# EAGLE design Skaarhoj VU board with LEDs (EAGLE 6.2)
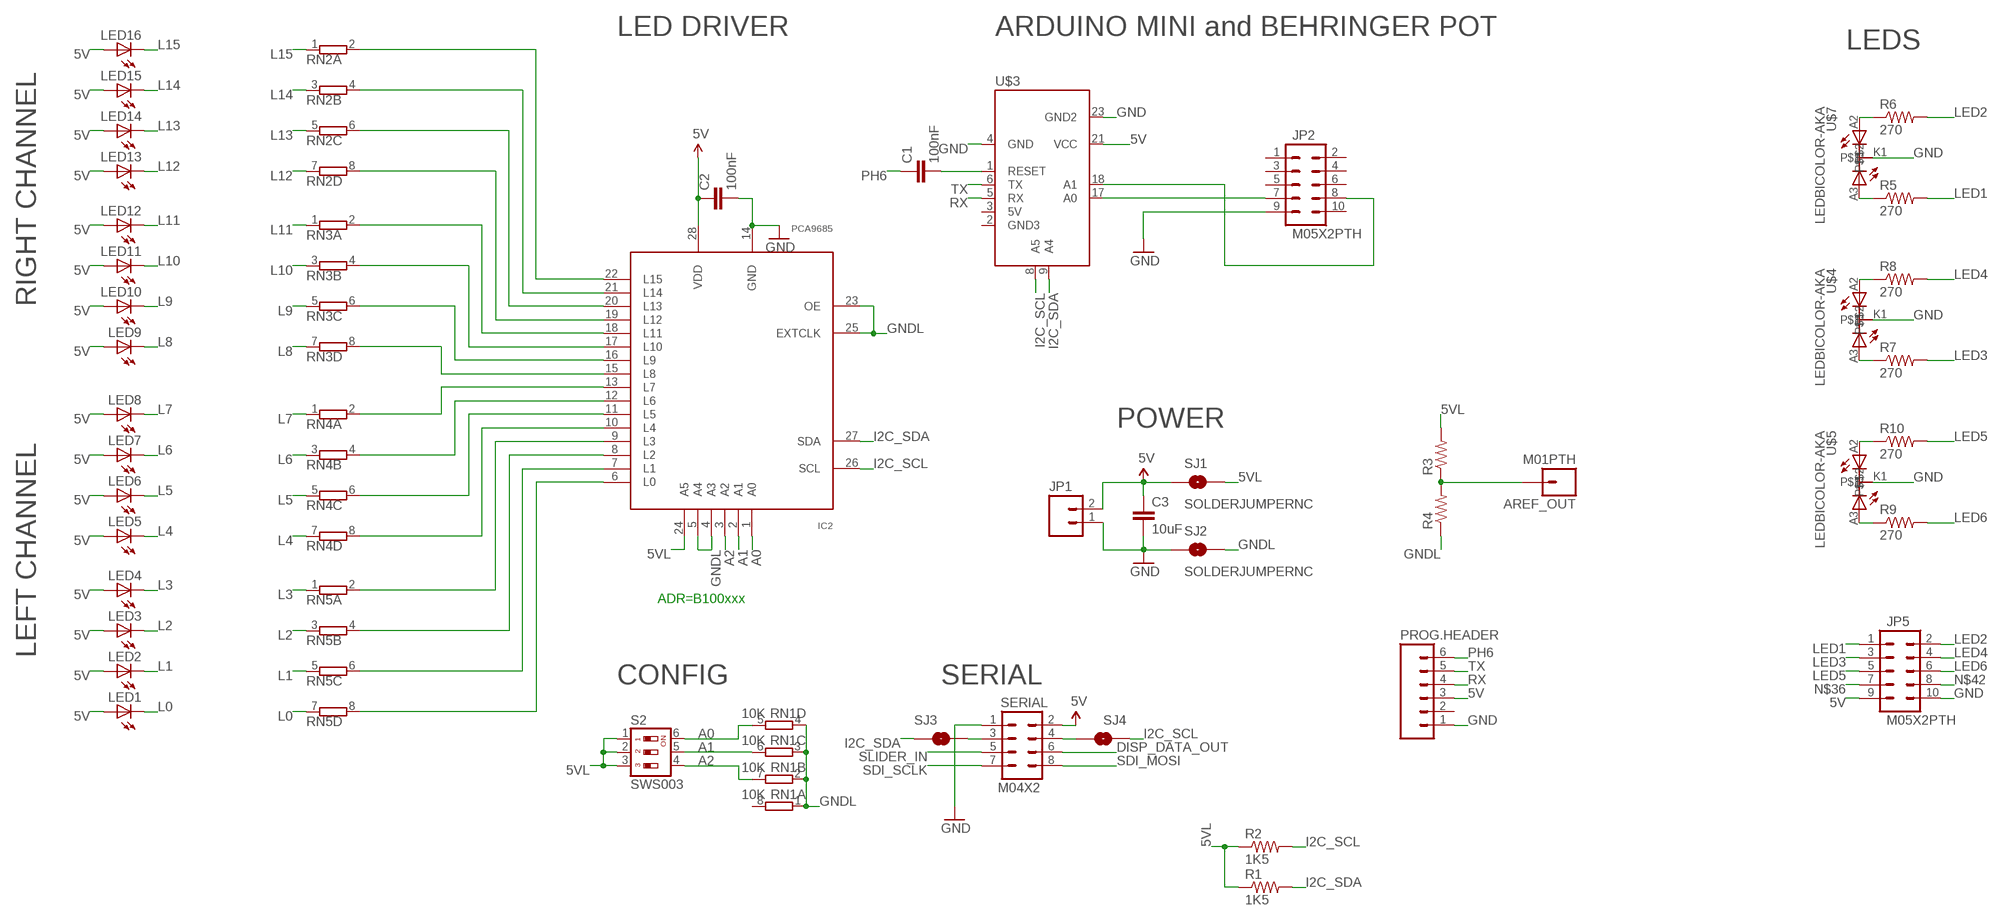
[diagram p0: schematic, sheet 1]

## Parts
AREF_OUT  M01PTH  [1X01]
C1  100nF  CAP0603-CAP  [0603-CAP]
C2  100nF  CAP0603-CAP  [0603-CAP]
C3  10uF  CAP0805  [0805]
IC2  PCA9685  [TSSOP28]
JP1  M02PTH  [1X02]
JP2  M05X2PTH  [AVR_ICSP]
JP5  M05X2PTH  [AVR_ICSP]
LED1  LED3MM  [LED3MM]
LED2  LED3MM  [LED3MM]
LED3  LED3MM  [LED3MM]
LED4  LED3MM  [LED3MM]
LED5  LED3MM  [LED3MM]
LED6  LED3MM  [LED3MM]
LED7  LED3MM  [LED3MM]
LED8  LED3MM  [LED3MM]
LED9  LED3MM  [LED3MM]
LED10  LED3MM  [LED3MM]
LED11  LED3MM  [LED3MM]
LED12  LED3MM  [LED3MM]
LED13  LED3MM  [LED3MM]
LED14  LED3MM  [LED3MM]
LED15  LED3MM  [LED3MM]
LED16  LED3MM  [LED3MM]
PROG.HEADER  M06LOCK  [1X06_LOCK]
R1  1K5  RESISTOR0603-RES  [0603-RES]
R2  1K5  RESISTOR0603-RES  [0603-RES]
R3  RESISTOR0603-RES  [0603-RES]
R4  RESISTOR0603-RES  [0603-RES]
R5  270  RESISTOR0603-RES  [0603-RES]
R6  270  RESISTOR0603-RES  [0603-RES]
R7  270  RESISTOR0603-RES  [0603-RES]
R8  270  RESISTOR0603-RES  [0603-RES]
R9  270  RESISTOR0603-RES  [0603-RES]
R10  270  RESISTOR0603-RES  [0603-RES]
RN1  10K  4R-NCAY16  [CAY16_HAND]
RN2  E4R  [SIL8]
RN3  E4R  [SIL8]
RN4  E4R  [SIL8]
RN5  E4R  [SIL8]
S2  SWS003  [SMS-003]
SERIAL  M04X2  [2X4]
SJ1  SOLDERJUMPERNC  [SJ_2S]
SJ2  SOLDERJUMPERNC  [SJ_2S]
SJ3  SOLDERJUMPERNC  [SJ_2S]
SJ4  SOLDERJUMPERNC  [SJ_2S]
U$3  ARDUINO_MINI_SE1  [ARDUINO_MINI_SE1]
U$4  LEDBICOLOR-AKA  [LED5MM-BICOLOR]
U$5  LEDBICOLOR-AKA  [LED5MM-BICOLOR]
U$7  LEDBICOLOR-AKA  [LED5MM-BICOLOR]

## Nets
5V [Power]: C2.1 C3.1 IC2.28(VDD) JP1.2 JP5.9 LED1.A LED2.A LED3.A LED4.A LED5.A LED6.A LED7.A LED8.A LED9.A LED10.A LED11.A LED12.A LED13.A LED14.A LED15.A LED16.A PROG.HEADER.3 SERIAL.2 SJ1.1 U$3.21(VCC)
5VL: IC2.24(A5) R1.1 R2.1 R3.2 S2.1 S2.2 S2.3 SJ1.2
A0: IC2.1(A0) RN1.5 S2.6
A1: IC2.2(A1) RN1.6 S2.5
A2: IC2.3(A2) RN1.7 S2.4
AREF: AREF_OUT.1 R3.1 R4.2
DISP_DATA_OUT: SERIAL.6
GND [Power]: C2.2 C3.2 IC2.14(GND) JP1.1 JP2.9 JP5.10 PROG.HEADER.1 SERIAL.1 SJ2.1 U$3.4(GND) U$3.23(GND2) U$4.K1 U$5.K1 U$7.K1
GNDL: IC2.4(A3) IC2.5(A4) IC2.23(OE) IC2.25(EXTCLK) R4.1 RN1.1 RN1.2 RN1.3 RN1.4 SJ2.2
I2C_SCL: IC2.26(SCL) R2.2 SJ4.2 U$3.8(A5)
I2C_SDA: IC2.27(SDA) R1.2 SJ3.1 U$3.9(A4)
L0: LED1.K(C) RN5.7
L1: LED2.K(C) RN5.5
L2: LED3.K(C) RN5.3
L3: LED4.K(C) RN5.1
L4: LED5.K(C) RN4.7
L5: LED6.K(C) RN4.5
L6: LED7.K(C) RN4.3
L7: LED8.K(C) RN4.1
L8: LED9.K(C) RN3.7
L9: LED10.K(C) RN3.5
L10: LED11.K(C) RN3.3
L11: LED12.K(C) RN3.1
L12: LED13.K(C) RN2.7
L13: LED14.K(C) RN2.5
L14: LED15.K(C) RN2.3
L15: LED16.K(C) RN2.1
LED1: JP5.1 R5.2
LED2: JP5.2 R6.2
LED3: JP5.3 R7.2
LED4: JP5.4 R8.2
LED5: JP5.5 R10.2
LED6: JP5.6 R9.2
N$3: SERIAL.3 SJ3.2
N$4: IC2.13(L7) RN4.2
N$5: IC2.12(L6) RN4.4
N$6: SERIAL.4 SJ4.1
N$7: IC2.11(L5) RN4.6
N$9: IC2.10(L4) RN4.8
N$10: IC2.9(L3) RN5.2
N$11: IC2.8(L2) RN5.4
N$12: IC2.7(L1) RN5.6
N$16: JP2.8 U$3.18(A1)
N$17: JP2.7 U$3.17(A0)
N$18: R6.1 U$7.A2
N$19: IC2.6(L0) RN5.8
N$20: IC2.15(L8) RN3.8
N$21: IC2.16(L9) RN3.6
N$22: IC2.17(L10) RN3.4
N$23: IC2.18(L11) RN3.2
N$24: IC2.19(L12) RN2.8
N$25: IC2.20(L13) RN2.6
N$26: IC2.21(L14) RN2.4
N$27: IC2.22(L15) RN2.2
N$28: R5.1 U$7.A3
N$29: R8.1 U$4.A2
N$30: R7.1 U$4.A3
N$31: R10.1 U$5.A2
N$32: R9.1 U$5.A3
N$36: JP5.7
N$37: C1.2 U$3.1(RESET)
N$42: JP5.8
PH6: C1.1 PROG.HEADER.6
RX: PROG.HEADER.4 U$3.5(RX)
SDI_MOSI: SERIAL.8
SDI_SCLK: SERIAL.7
SLIDER_IN: SERIAL.5
TX: PROG.HEADER.5 U$3.6(TX)
Unconnected: JP2.1 JP2.2 JP2.3 JP2.4 JP2.5 JP2.6 JP2.10 PROG.HEADER.2 RN1.8 U$3.2(GND3) U$3.3(5V)

## Notes on the sheet
- LED DRIVER | ARDUINO MINI and BEHRINGER POT
- LEDS
- RIGHT CHANNEL
- POWER
- ADR=B100xxx
- LEFT CHANNEL
- CONFIG | SERIAL

## Library data of the parts
AREF_OUT = SparkFun:M01: Header 1 Standard 1-pin 0.1" header. Use with straight break away headers (SKU : PRT-00116), right angle break away headers (PRT-00553), swiss pins (PRT-00743), machine pins (PRT-00117), and female headers (PRT-00115).
C1-C3 = SparkFun:CAP: Capacitor Standard 0603 ceramic capacitor, and 0.1" leaded capacitor.
IC2 = wsmith:PCA9685
JP1 = SparkFun:M02: Header 2 Standard 2-pin 0.1" header. Use with straight break away headers (SKU : PRT-00116), right angle break away headers (PRT-00553), swiss pins (PRT-00743), machine pins (PRT-00117), and female headers (PRT-00115). Molex polarized connector foot print use with SKU : PRT-08233 with associated crimp pins and housings.
JP2 JP5 = SparkFun:M05X2: Header 5x2 Standard 10-pin dual row 0.1" header. Commonly used with AVR-ISP. Use with Spark Fun Electronics SKU: PRT-00778
LED1-LED16 = SparkFun:LED: LEDs Standard schematic elements and footprints for 5mm, 3mm, 1206, and 0603 sized LEDs. 5mm - Spark Fun Electronics SKU : COM-00529 (and others)
PROG.HEADER = SparkFun:M06: Header 6 Standard 6-pin 0.1" header. Use with straight break away headers (SKU : PRT-00116), right angle break away headers (PRT-00553), swiss pins (PRT-00743), machine pins (PRT-00117), and female headers (PRT-00115). Molex polarized connector foot print use with SKU : PRT-08094 with associated crimp pins and housings. NOTES ON THE VARIANTS LOCK and LOCK_LONGPADS... This footprint was designed to help hold the alignment of a through-hole component (i.e. 6-pin header) while soldering it into place. You may notice that each hole has been shifted either up or down by 0.005 of an inch from it's more standard position (which is a perfectly straight line). This slight alteration caused the pins (the squares in the middle) to touch the edges of the holes. Because they are alternating, it causes a "brace" to hold the component in place. 0.005 has proven to be the perfect amount of "off-center" position when using our standard breakaway headers. Although looks a little odd when you look at the bare footprint, once you have a header in there, the alteration is very hard to notice. Also, if you push a header all the way into place, it is covered up entirely on the bottom side. This idea of altering the position of holes to aid alignment will be further integrated into the Sparkfun Library for other footprints. It can help hold any component with 3 or more connection pins.
R1-R10 = SparkFun:RESISTOR: Resistor Basic schematic elements and footprints for 0603, 1206, and PTH resistors.
RN1 = SKAARHOJ:4R-N: Array Chip Resistor Source: RS Component / Phycomp; OC_FARNELL: unknown; OC_NEWARK: unknown
RN2-RN5 = SKAARHOJ:E4R: SIL RESISTOR; OC_FARNELL: unknown; OC_NEWARK: unknown
S2 = smd-special:SWS003: SMD Dip Switch 3 pol.
SERIAL = SparkFun:M04X2
SJ1-SJ4 = SparkFun:SOLDERJUMPER: Solder Jumper Standard SMD solder jumper. Used to automate production. Two varients : Normally Open and Normally Closed are the same, but have different paste layers. NC will have a large amount of paste and should jumper during reflow.
U$3 = SKAARHOJ:ARDUINO_MINI_SE1
U$4 U$5 U$7 = SKAARHOJ:LEDBICOLOR-AKA

## Net classes
0 default: width 0.152 mm, drill 0.305 mm, clearance 0.152 mm
1 Power: width 0.406 mm, drill 0.61 mm, clearance 0.203 mm

## Board
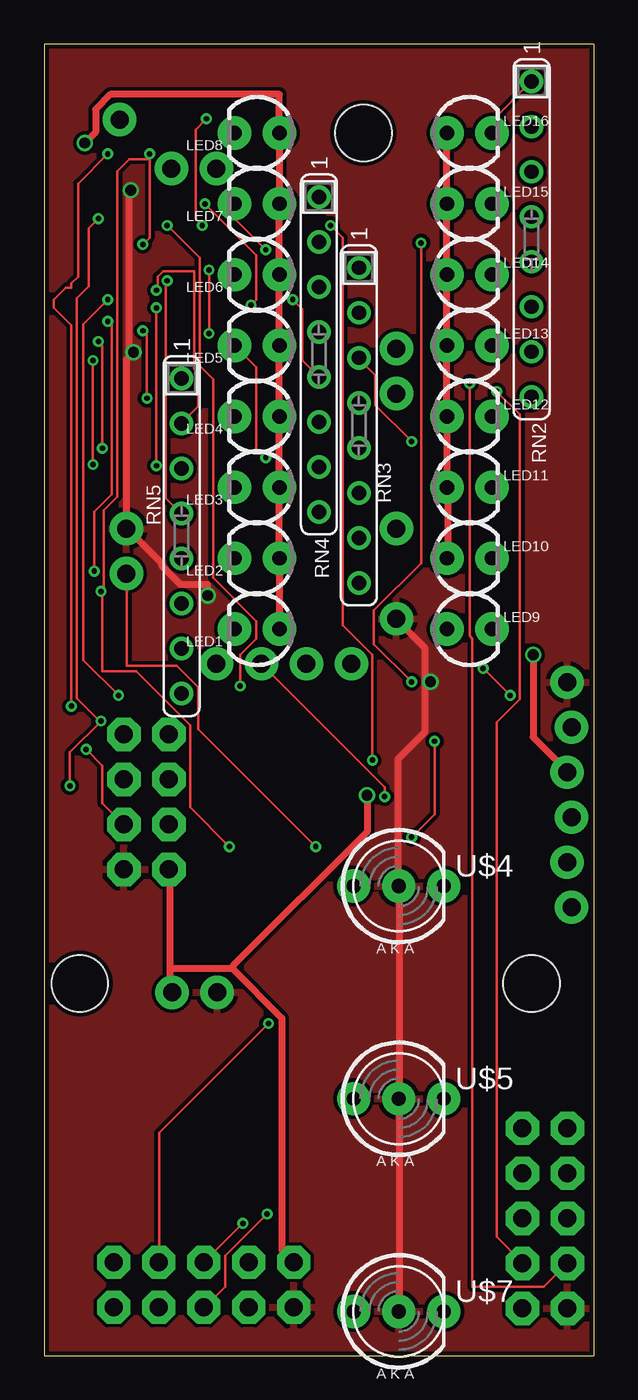
[diagram p1: board, top side]
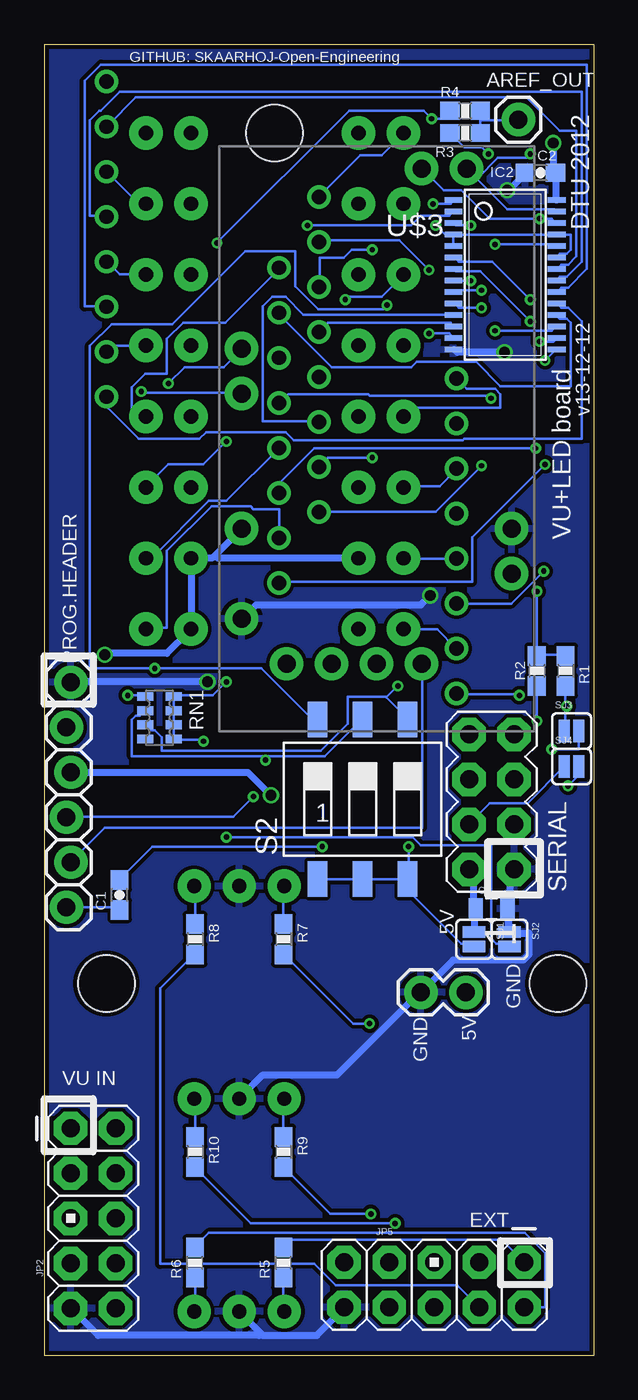
[diagram p2: board, bottom side, seen from below]

Size 31 x 74 mm. Coordinates in mm from the lower left corner, seen from the top.
Outline: 0,0 31,0 31,74 0,74 0,0
Copper layers (1*16): Top 0.035mm / dielectric 1.5mm / Bottom 0.035mm
Design rules: minimum track width 6mil, minimum drill 12mil, track to track 6mil, track to pad 6mil, pad to pad 6mil, via to via 6mil, smd to smd 0mil, copper to edge 10mil, drill to drill 10mil, minimum pad ring 10mil, minimum via ring 6mil, stop-mask expansion 2mil, vias tented up to drill 100mil, thermal gap 10mil
Holes 3.2 mm at 2,21 27.5,21 18,69

### Footprints (pad centres in the part's own frame; a part is rotated, then mirrored left to right if it is on the bottom)
1X01 = drill 1.016 pad 1.88: 1 0,0
0603-CAP = smd 1.1 x 1: 1 -0.85,0; 2 0.85,0
0805 = smd 0.8 x 1.2: 1 -0.9,0; 2 0.9,0
TSSOP28 = smd 0.305 x 0.991: 1 -4.225,-2.918; 2 -3.575,-2.918; 3 -2.925,-2.918; 4 -2.275,-2.918; 5 -1.625,-2.918; 6 -0.975,-2.918; 7 -0.325,-2.918; 8 0.325,-2.918; 9 0.975,-2.918; 10 1.625,-2.918; 11 2.275,-2.918; 12 2.925,-2.918; 13 3.575,-2.918; 14 4.225,-2.918; 15 4.225,2.918; 16 3.575,2.918; 17 2.925,2.918; 18 2.275,2.918; 19 1.625,2.918; 20 0.975,2.918; 21 0.325,2.918; 22 -0.325,2.918; 23 -0.975,2.918; 24 -1.625,2.918; 25 -2.275,2.918; 26 -2.925,2.918; 27 -3.575,2.918; 28 -4.225,2.918
1X02 = drill 1.016 pad 1.88: 1 0,0; 2 2.54,0
AVR_ICSP = drill 1.016 pad 1.88 octagon: 1 -1.27,5.08; 2 1.27,5.08; 3 -1.27,2.54; 4 1.27,2.54; 5 -1.27,0; 6 1.27,0; 7 -1.27,-2.54; 8 1.27,-2.54; 9 -1.27,-5.08; 10 1.27,-5.08
LED3MM = drill 0.813 pad 1.88: A -1.27,0; K 1.27,0
1X06_LOCK = drill 1.016 pad 1.88: 1 0,0; 2 2.54,-0.254; 3 5.08,0; 4 7.62,-0.254; 5 10.16,0; 6 12.7,-0.254
0603-RES = smd 1.1 x 1: 1 -0.85,0; 2 0.85,0
CAY16_HAND = smd 0.5 x 0.904: 1 -1.2,-0.813; 2 -0.4,-0.813; 3 0.4,-0.813; 4 1.2,-0.813; 5 1.2,0.813; 6 0.4,0.813; 7 -0.4,0.813; 8 -1.2,0.813
SIL8 = drill 0.813: 1 -8.89,0; 2 -6.35,0; 3 -3.81,0; 4 -1.27,0; 5 1.27,0; 6 3.81,0; 7 6.35,0; 8 8.89,0
SMS-003 = smd 1.092 x 2.007: 1 -2.54,-4.496; 2 0,-4.496; 3 2.54,-4.496; 4 2.54,4.496; 5 0,4.496; 6 -2.54,4.496
2X4 = drill 1.016 pad 1.88 octagon: 1 -3.81,-1.27; 2 -3.81,1.27; 3 -1.27,-1.27; 4 -1.27,1.27; 5 1.27,-1.27; 6 1.27,1.27; 7 3.81,-1.27; 8 3.81,1.27
SJ_2S = smd 0.635 x 1.27: 1 -0.412,0; 2 0.412,0
ARDUINO_MINI_SE1 = drill 1.016 pad 1.88: 1 -7.62,7.62; 2 5.08,12.7; 3 2.54,12.7; 4 -7.62,5.08; 5 0,12.7; 6 -2.54,12.7; 8 -2.54,-15.24; 9 -5.08,-15.24; 17 7.62,-5.08; 18 7.62,-2.54; 21 7.62,5.08; 23 7.62,10.16
LED5MM-BICOLOR = drill 0.813 pad 1.88: A2 2.54,0; A3 -2.54,0; K1 0,0

### Placement (x,y rotation side)
AREF_OUT  4.25,69.75 0 bottom
C1  26.75,26 90 bottom
C2  3,66.75 180 bottom
C3  5.76,25.23 0 bottom
IC2  5,61 270 bottom
JP1  9.75,20.5 0 bottom
JP2  28.25,7.75 0 bottom
JP5  9,4 270 bottom
LED1  12,41 180 top
LED2  12,45 180 top
LED3  12,49 180 top
LED4  12,53 180 top
LED5  12,57 180 top
LED6  12,61 180 top
LED7  12,65 180 top
LED8  12,69 180 top
LED9  24,41 0 top
LED10  24,45 0 top
LED11  24,49 0 top
LED12  24,53 0 top
LED13  24,57 0 top
LED14  24,61 0 top
LED15  24,65 0 top
LED16  24,69 0 top
PROG.HEADER  29.5,38 270 bottom
R1  1.58,38.65 270 bottom
R2  3.21,38.65 270 bottom
R3  7.25,69 180 bottom
R4  7.25,70.25 0 bottom
R5  17.5,5.25 90 bottom
R6  22.5,5.25 90 bottom
R7  17.5,23.5 270 bottom
R8  22.5,23.5 270 bottom
R9  17.5,11.5 270 bottom
R10  22.5,11.5 270 bottom
RN1  24.5,36 90 bottom
RN2  27.5,63 270 top
RN3  17.75,52.5 270 top
RN4  15.5,56.5 270 top
RN5  7.75,46.25 270 top
S2  13.04,31.4 0 bottom
SERIAL  5.76,31.25 90 bottom
SJ1  6.75,23.5 270 bottom
SJ2  4.75,23.5 270 bottom
SJ3  1.25,35.25 0 bottom
SJ4  1.25,33.25 0 bottom
U$3  12.25,51.75 180 bottom
U$4  20,26.5 0 top
U$5  20,14.5 0 top
U$7  20,2.5 0 top

### Tracks (layer width: path | path; a pad name or v marks a point on that pad's centre or on a via)
5V  (via drill 0.61)
  Top 0.406: v2.29,68.43 2.9,69.04 2.9,70.33 3.73,71.17 13.26,71.17 13.26,69.04 LED8.A 13.26,68.81 13.26,65.08 LED7.A 13.26,64.85 13.26,61.19 LED6.A 13.26,60.96 13.26,57.15 LED5.A 13.26,53.19 LED4.A 13.26,52.96 13.26,49.15 LED3.A 13.26,45.19 LED2.A 13.26,44.96 13.26,41.07 LED1.A | 7.09,21.87 7.09,27.43 SERIAL.2 | 7.09,21.87 7.09,20.65 7.16,20.57 JP1.2 | 10.59,21.87 13.41,19.05 13.41,5.94 14.02,5.33 JP5.9 | 7.09,21.87 10.59,21.87 | LED16.A 22.71,68.96 22.71,65.15 LED15.A 22.71,65 22.71,61.19 LED14.A 22.71,60.96 22.71,57.15 LED13.A 22.71,57 22.71,53.19 LED12.A 22.71,52.96 22.71,49.07 LED11.A 22.78,48.84 22.78,45.03 LED10.A | v27.58,39.55 27.58,34.9 29.49,32.99 PROG.HEADER.3 | v18.21,31.62 18.21,29.57 10.67,22.02 10.59,21.87
  Bottom 0.406: IC2.28 2.13,65.23 2.13,66.67 C2.1 2.29,66.9 v2.29,68.43 | SJ1.1 6.71,23.93 6.71,25.22 C3.1 6.78,25.38 6.78,27.43 7.01,27.43 SERIAL.2 | 21.37,45.15 21.49,45.03 22.71,45.03 LED10.A 22.71,44.81 22.71,41.07 LED9.A 22.86,40.84 24.08,39.62 27.51,39.62 v27.58,39.55 | 21.37,45.15 19.89,46.63 U$3.21 | v18.21,31.62 19.51,32.92 PROG.HEADER.3 | LED2.A 13.34,45.03 21.26,45.03 21.37,45.15
5VL  (via drill 0.3)
  Top 0.152: v5.56,62.71 5.94,63.09 5.94,67.51 | v5.94,67.82 5.94,67.51 | 5.94,67.51 4.8,67.51 4.12,66.83 4.12,48.46 3.35,47.7 3.35,43.28 v3.2,43.13 3.28,43.13 3.28,38.63 5.18,38.63 8.23,35.59 8.23,30.94 v10.44,28.73
  Bottom 0.152: S2.1 15.54,26.9 13.11,26.9 S2.2 10.52,26.9 S2.3 | SJ1.2 6.78,23.09 6.93,23.24 7.47,23.24 10.44,26.21 10.44,26.9 S2.3 | R1.1 1.6,39.55 3.2,39.55 R2.1 3.2,39.62 v3.2,43.13 | v5.56,62.71 2.21,62.71 2.13,62.64 IC2.24 | v5.94,67.82 6.33,68.2 7.32,68.2 8.08,68.96 R3.2 | v10.44,28.73 10.44,26.98 S2.3
A0  (via drill 0.3)
  Top 0.152: v24.77,38.79 v26.29,37.26 | v9.07,65 11.96,62.1 11.96,59.59 v11.66,59.28
  Bottom 0.152: v26.29,37.26 25.38,37.26 RN1.5 | S2.6 15.62,35.97 15.93,35.97 18.75,38.79 v24.77,38.79 28.42,38.79 28.42,57 27.2,58.22 23.77,58.22 19.66,62.33 16.84,62.33 16.84,60.35 15.54,59.05 11.89,59.05 v11.66,59.28 | v9.07,65 8.08,65 7.92,65.15 IC2.1
A1  (via drill 0.3)
  Top 0.152: v16.15,63.78 16.84,63.09 16.84,41.22 18.52,39.55 v18.52,33.6
  Bottom 0.152: 18.52,33.83 15.16,33.83 13.11,35.89 S2.5 | 18.52,33.83 26.06,33.83 26.06,35.89 25.83,36.12 25.6,36.12 25.38,36.35 RN1.6 | v16.15,63.78 10.29,63.78 9.75,64.31 8.15,64.31 7.92,64.54 IC2.2 | 18.52,33.83 v18.52,33.6
A2  (via drill 0.3)
  Top 0.152: v6.93,63.78 8.76,61.95 8.76,55.85 9.53,55.09 9.53,43.89 11.96,41.45 11.96,40.46 11.05,39.55 v11.05,37.8
  Bottom 0.152: 11.7,37.15 10.52,35.97 S2.4 | 11.7,37.15 11.73,37.19 13.87,37.19 13.87,35.66 15.39,34.14 24.38,34.14 24.38,34.9 24.77,35.28 24.99,35.28 25.3,35.59 RN1.7 | v6.93,63.78 7.77,63.78 7.85,63.86 IC2.3 | 11.7,37.15 v11.05,37.8
AREF
  Bottom 0.152: 6.4,69.72 6.4,70.18 R4.2 | 6.4,69.72 6.4,69.04 R3.1 | 6.4,69.72 4.27,69.72 AREF_OUT.1
GND  (via drill 0.61)
  Top 0.406: v4.88,65.76 4.8,65.68 4.8,56.62 v5.03,56.62 4.65,56.24 4.65,46.71 U$3.4 4.8,46.56 6.63,44.73 6.63,44.58 7.7,43.51 9.22,43.51 v9.22,42.9 | 21.49,38.02 21.49,35.2 19.96,33.68 19.96,26.67 U$4.K1 20.04,26.44 20.04,14.55 U$5.K1 20.04,14.33 20.04,2.52 U$7.K1 | 21.49,38.02 21.49,39.93 19.89,41.53 U$3.23 | v21.79,38.02 21.49,38.02
  Bottom 0.406: v5.03,56.62 7.7,56.62 7.85,56.77 IC2.14 | v4.88,65.76 4.8,65.76 3.89,66.67 C2.2 | 18.78,1.26 19.96,2.44 U$7.K1 | 18.78,1.26 18.67,1.14 15.62,1.14 14.1,2.67 JP5.10 | JP2.9 29.49,2.67 27.96,1.14 18.9,1.14 18.78,1.26 | SERIAL.1 4.72,27.43 4.72,25.38 C3.2 4.8,25.22 4.8,23.93 SJ2.1 4.57,23.85 3.66,23.85 3.66,22.63 3.96,22.33 7.92,22.33 9.68,20.57 JP1.1 9.91,20.42 14.48,15.85 18.67,15.85 19.96,14.55 U$5.K1 | v21.79,38.02 29.49,38.02 PROG.HEADER.1 | v9.22,42.9 9.75,42.37 19.05,42.37 19.81,41.6 U$3.23
  pour Bottom: 0,0 0,74 31,74 31,0
  pour Top: 0,0 31,0 31,74 0,74
GNDL  (via drill 0.3)
  Top 0.152: v9.14,69.8 8.53,69.19 8.53,64.16 v8.91,63.78 | v20.73,29.26 22.02,30.56 v22.02,34.67 | v21.26,62.79 21.26,44.73 18.59,42.06 18.59,40.16 v20.73,38.02
  Bottom 0.152: IC2.23 2.06,62.03 1.91,62.18 1.52,62.18 1.29,62.41 1.29,63.25 2.06,63.25 IC2.25 2.13,63.25 7.85,63.25 IC2.4 | IC2.5 7.92,62.64 7.92,63.25 IC2.4 | v8.91,63.78 8.38,63.25 8,63.25 IC2.4 | R4.1 8.15,70.18 8.53,69.8 v9.14,69.8 9.6,70.26 13.79,70.26 v21.26,62.79 | v20.73,29.26 10.21,29.26 9.75,28.8 5.79,28.8 5.79,23.55 5.49,23.24 4.95,23.24 4.8,23.09 SJ2.2 | v22.02,34.67 22.1,34.75 23.62,34.75 RN1.1 23.7,34.82 23.7,35.59 RN1.2 23.7,35.66 23.7,36.35 RN1.3 23.7,36.42 23.7,37.19 RN1.4 23.62,37.26 21.49,37.26 v20.73,38.02
I2C_SCL  (via drill 0.3)
  Top 0.152: v1.45,32.16 1.45,34.06 v3.2,35.81 3.12,35.81 1.83,37.11 1.83,59.66 2.52,60.35 2.52,63.63 v3.05,64.16
  Bottom 0.152: v3.2,35.81 R2.2 | v1.45,32.16 0.84,32.77 0.84,33.22 SJ4.2 | IC2.26 2.13,63.93 2.36,64.16 v3.05,64.16 5.87,64.16 7.47,65.76 8.46,65.76 9.68,66.98 U$3.8
I2C_SDA  (via drill 0.3)
  Top 0.152: v1.52,36.65 1.52,58.14 0.53,59.13 0.53,59.59 1.22,60.27 1.52,60.27 1.52,60.5 1.91,60.88 1.91,66.14 v3.58,67.82
  Bottom 0.152: 1.6,36.65 1.6,35.28 SJ3.1 | 1.6,36.65 1.6,37.8 R1.2 | IC2.27 2.13,64.62 2.21,64.69 4.88,64.69 U$3.9 6.55,66.45 5.41,67.59 3.81,67.59 v3.58,67.82 | v1.52,36.65 1.6,36.65
L0
  Bottom 0.152: RN5.7 7.77,39.93 8.84,41 10.67,41 LED1.K
L1
  Bottom 0.152: RN5.5 7.77,44.96 10.67,44.96 LED2.K
L2
  Bottom 0.152: RN5.3 7.77,49.99 8.69,49.07 10.67,49.07 LED3.K
L3
  Bottom 0.152: RN5.1 7.7,55.09 7.16,54.56 5.56,54.56 5.26,54.25 5.26,53.49 10.21,53.49 10.67,53.03 LED4.K
L4  (via drill 0.3)
  Top 0.152: v12.5,50.67 11.96,51.21 11.96,55.78 10.74,57 LED5.K
  Bottom 0.152: v12.5,50.67 15.01,50.67 15.47,50.22 RN4.7
L5  (via drill 0.3)
  Top 0.152: v14.02,59.59 14.55,59.05 14.55,56.16 15.47,55.24 RN4.5
  Bottom 0.152: v14.02,59.59 13.87,59.74 11.96,59.74 10.74,60.96 LED6.K
L6  (via drill 0.3)
  Top 0.152: v12.5,62.41 10.74,64.16 10.74,65 LED7.K
  Bottom 0.152: v12.5,62.41 13.64,62.41 14.1,61.95 15.47,61.95 15.47,60.35 RN4.3
L7
  Bottom 0.152: RN4.1 15.47,65.46 13.18,67.74 11.96,67.74 10.74,68.96 LED8.K
L8
  Bottom 0.152: RN3.7 17.75,46.18 17.75,47.78 19.2,47.78 19.36,47.93 21.57,47.93 24.08,45.41 24.08,41.07 25.22,41.07 LED9.K
L9
  Bottom 0.152: RN3.5 17.75,51.21 20.73,48.23 21.72,48.23 24.92,45.03 25.22,45.03 LED10.K
L10  (via drill 0.3)
  Top 0.152: v20.73,51.59 18.67,53.65 18.67,55.32 17.75,56.24 RN3.3
  Bottom 0.152: v20.73,51.59 22.02,50.29 24,50.29 25.22,49.07 LED11.K
L11
  Bottom 0.152: RN3.1 17.75,61.34 20.8,58.29 23.16,58.29 24.08,57.38 24.08,55.4 25.3,55.4 26.06,54.63 26.06,53.03 25.3,53.03 LED12.K
L12
  Bottom 0.152: RN2.7 27.43,56.69 27.13,57 25.3,57 LED13.K
L13
  Bottom 0.152: RN2.5 27.43,61.72 26.75,61.04 25.3,61.04 LED14.K
L14
  Bottom 0.152: RN2.3 27.43,66.75 25.76,65.08 25.3,65.08 LED15.K
L15
  Top 0.152: RN2.1 27.43,71.86 25.3,69.72 25.3,69.04 LED16.K
LED1
  Bottom 0.152: R5.2 17.45,6.17 17.07,6.55 5.18,6.55 3.96,5.33 JP5.1
LED2
  Bottom 0.152: R6.2 22.48,6.17 21.72,6.93 3.89,6.93 2.74,5.79 2.74,2.74 3.89,2.74 JP5.2
LED3  (via drill 0.3)
  Top 0.152: v12.65,18.75 6.48,12.57 6.48,5.33 JP5.3
  Bottom 0.152: v12.65,18.75 13.56,18.75 17.45,22.63 R7.2
LED4
  Bottom 0.152: R8.2 22.55,22.63 24.46,20.73 24.46,5.18 15.77,5.18 14.55,3.96 7.7,3.96 6.48,2.74 JP5.4
LED5  (via drill 0.3)
  Top 0.152: v11.2,7.47 9.07,5.33 JP5.5
  Bottom 0.152: v11.2,7.47 19.36,7.47 22.48,10.59 R10.2
LED6  (via drill 0.3)
  Top 0.152: v12.57,8 10.21,5.64 10.21,3.89 9.07,2.74 JP5.6
  Bottom 0.152: v12.57,8 14.86,8 17.45,10.59 R9.2
N$3  (via drill 0.3)
  Top 0.152: v2.36,34.21 3.28,33.3 3.28,31.17 4.42,30.02 SERIAL.3
  Bottom 0.152: v2.36,34.21 0.84,34.21 0.84,35.2 SJ3.2
N$4  (via drill 0.3)
  Top 0.152: v9.3,61.27 v9.3,57.68
  Bottom 0.152: v9.3,57.68 8.15,57.68 7.92,57.45 IC2.13 | v9.3,61.27 10.97,62.94 15.39,62.94 15.47,62.87 RN4.2
N$5
  Bottom 0.152: IC2.12 7.92,58.14 8.08,58.29 15.01,58.29 15.47,57.84 RN4.4
N$6
  Bottom 0.152: SJ4.1 1.68,33.22 3.73,31.17 5.87,31.17 7.01,30.02 SERIAL.4
N$7
  Bottom 0.152: IC2.11 7.92,58.75 16.38,58.75 17.37,59.74 18.14,59.74 18.67,59.21 18.67,52.73 15.54,52.73 RN4.6
N$9  (via drill 0.3)
  Top 0.152: v6.33,50.22 v6.33,59.13
  Bottom 0.152: v6.33,59.13 7.62,59.13 7.85,59.36 IC2.10 | v6.33,50.22 8.91,47.62 15.47,47.62 RN4.8
N$10  (via drill 0.3)
  Top 0.152: v6.33,60.12 6.4,60.2 6.4,60.88 6.71,61.19 8.46,61.19 8.46,55.7 8.69,55.47 8.69,53.57 7.77,52.65 RN5.2
  Bottom 0.152: v6.33,60.12 7.77,60.12 7.85,60.05 IC2.9
N$11  (via drill 0.3)
  Top 0.152: v6.93,60.66 6.86,60.58 6.86,48.39 7.7,47.55 RN5.4
  Bottom 0.152: v6.93,60.66 7.85,60.66 IC2.8
N$12  (via drill 0.3)
  Top 0.152: v3.58,58.37 3.81,58.14 3.81,48.62 2.82,47.62 v2.82,44.27
  Bottom 0.152: v3.58,58.37 6.4,61.19 7.77,61.19 7.85,61.27 IC2.7 | v2.82,44.27 4.65,42.44 7.7,42.44 RN5.6
N$16  (via drill 0.3)
  Top 0.152: v25.53,54.41 26.82,53.11 26.82,37.03 25.53,35.74 25.53,6.71 26.98,5.26 JP2.8
  Bottom 0.152: v25.53,54.41 25.45,54.33 19.89,54.33 U$3.18
N$17  (via drill 0.3)
  Top 0.152: v24,54.86 24,40.62 24.16,40.46 24.16,3.89 28.19,3.89 29.49,5.18 JP2.7
  Bottom 0.152: v24,54.86 23.09,55.78 20.88,55.78 19.89,56.77 U$3.17
N$18
  Bottom 0.152: R6.1 22.48,4.34 22.48,2.52 U$7.A2
N$19  (via drill 0.3)
  Top 0.152: v3.58,59.59 2.21,58.22 2.21,39.24 v4.19,37.26
  Bottom 0.152: v3.58,59.59 5.71,61.72 7.62,61.72 7.85,61.95 IC2.6 | v4.19,37.26 4.27,37.34 7.7,37.34 RN5.8
N$20  (via drill 0.3)
  Top 0.152: v2.74,50.29 v2.74,56.16
  Bottom 0.152: v2.74,56.16 2.13,56.77 IC2.15 | v2.74,50.29 6.86,46.18 6.86,43.66 17.68,43.66 RN3.8
N$21  (via drill 0.3)
  Top 0.152: v3.05,57.23 3.28,57 v3.28,51.21
  Bottom 0.152: v3.05,57.23 2.29,57.23 2.13,57.38 IC2.16 | v3.28,51.21 15.77,51.21 17.68,49.3 17.68,48.69 RN3.6
N$22  (via drill 0.3)
  Top 0.152: v5.56,57.84 5.79,57.61 v5.79,54.03
  Bottom 0.152: v5.56,57.84 2.36,57.84 2.13,58.06 IC2.17 | v5.79,54.03 5.94,54.18 12.65,54.18 12.72,54.25 17.22,54.25 17.68,53.8 RN3.4
N$23
  Bottom 0.152: IC2.18 2.06,58.67 1.91,58.52 1.52,58.52 1.29,58.29 1.29,54.71 5.26,54.71 6.63,56.08 9.98,56.08 10.29,55.78 14.78,55.78 17.68,58.67 17.68,58.83 RN3.2
N$24
  Bottom 0.152: IC2.19 2.06,59.36 1.83,59.13 1.45,59.13 0.69,58.37 0.69,51.74 7.32,51.74 7.39,51.66 16.92,51.66 17.37,52.12 21.87,52.12 22.25,51.74 25.68,51.74 27.43,53.49 27.43,54.1 RN2.8
N$25
  Bottom 0.152: IC2.20 2.06,60.05 1.83,60.27 1.45,60.27 0.38,61.34 0.38,72.85 27.81,72.85 28.73,71.93 28.73,59.21 27.51,59.21 RN2.6
N$26
  Bottom 0.152: IC2.21 2.06,60.73 1.91,60.88 1.52,60.88 0.69,61.72 0.69,71.32 26.75,71.32 27.81,70.26 27.89,70.26 28.42,69.72 28.42,64.31 27.51,64.31 RN2.4
N$27
  Bottom 0.152: IC2.22 2.06,61.34 1.83,61.57 1.45,61.57 0.99,62.03 0.99,69.11 1.91,69.11 3.81,71.02 25.83,71.02 27.43,69.42 RN2.2
N$28
  Bottom 0.152: R5.1 17.53,4.34 17.53,2.52 U$7.A3
N$29
  Bottom 0.152: R8.1 22.48,24.38 22.48,26.44 U$4.A2
N$30
  Bottom 0.152: R7.1 17.53,24.38 17.53,26.44 U$4.A3
N$31
  Bottom 0.152: R10.1 22.48,12.42 22.48,14.48 U$5.A2
N$32
  Bottom 0.152: R9.1 17.53,12.42 17.53,14.48 U$5.A3
N$37  (via drill 0.3)
  Top 0.152: v15.32,28.73 8.69,35.36 8.69,37.72 7.47,38.94 4.65,38.94 4.65,44.12 U$3.1
  Bottom 0.152: v15.32,28.73 24.92,28.73 26.75,26.9 C1.2
PH6
  Bottom 0.152: C1.1 26.82,25.22 26.9,25.3 29.72,25.3 PROG.HEADER.6
RX  (via drill 0.3)
  Top 0.152: v19.2,31.55 19.2,32.08 12.27,39.01 U$3.5
  Bottom 0.152: v19.2,31.55 20.34,30.4 29.72,30.4 PROG.HEADER.4
TX
  Bottom 0.152: U$3.6 9.68,39.01 9.68,29.79 27.58,29.79 29.49,27.89 PROG.HEADER.5

### Text on the board
_bsilk: GITHUB: SKAARHOJ-Open-Engineering | DTU 2012 | VU+LED board | v13-12-12 | 5V | 1 | GND | 5V | GND | VU IN | EXT